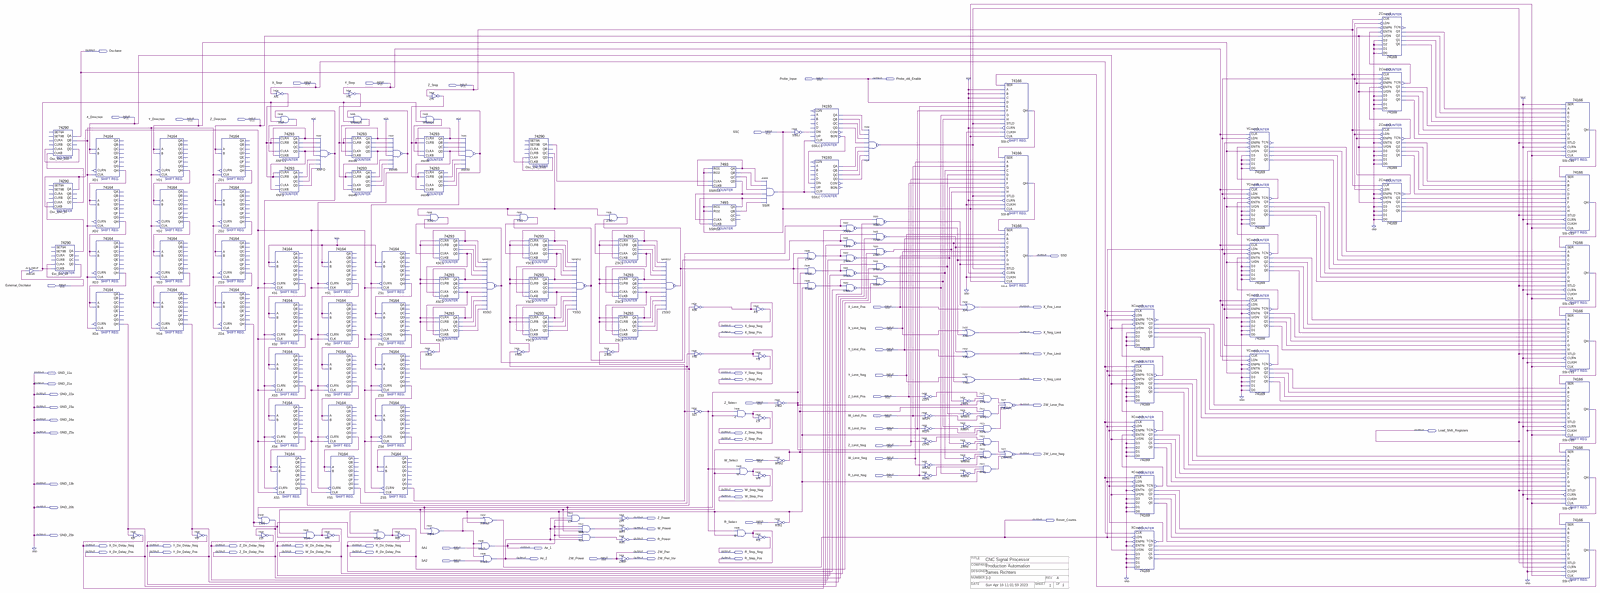
[diagram p0: schematic sheet, whole]
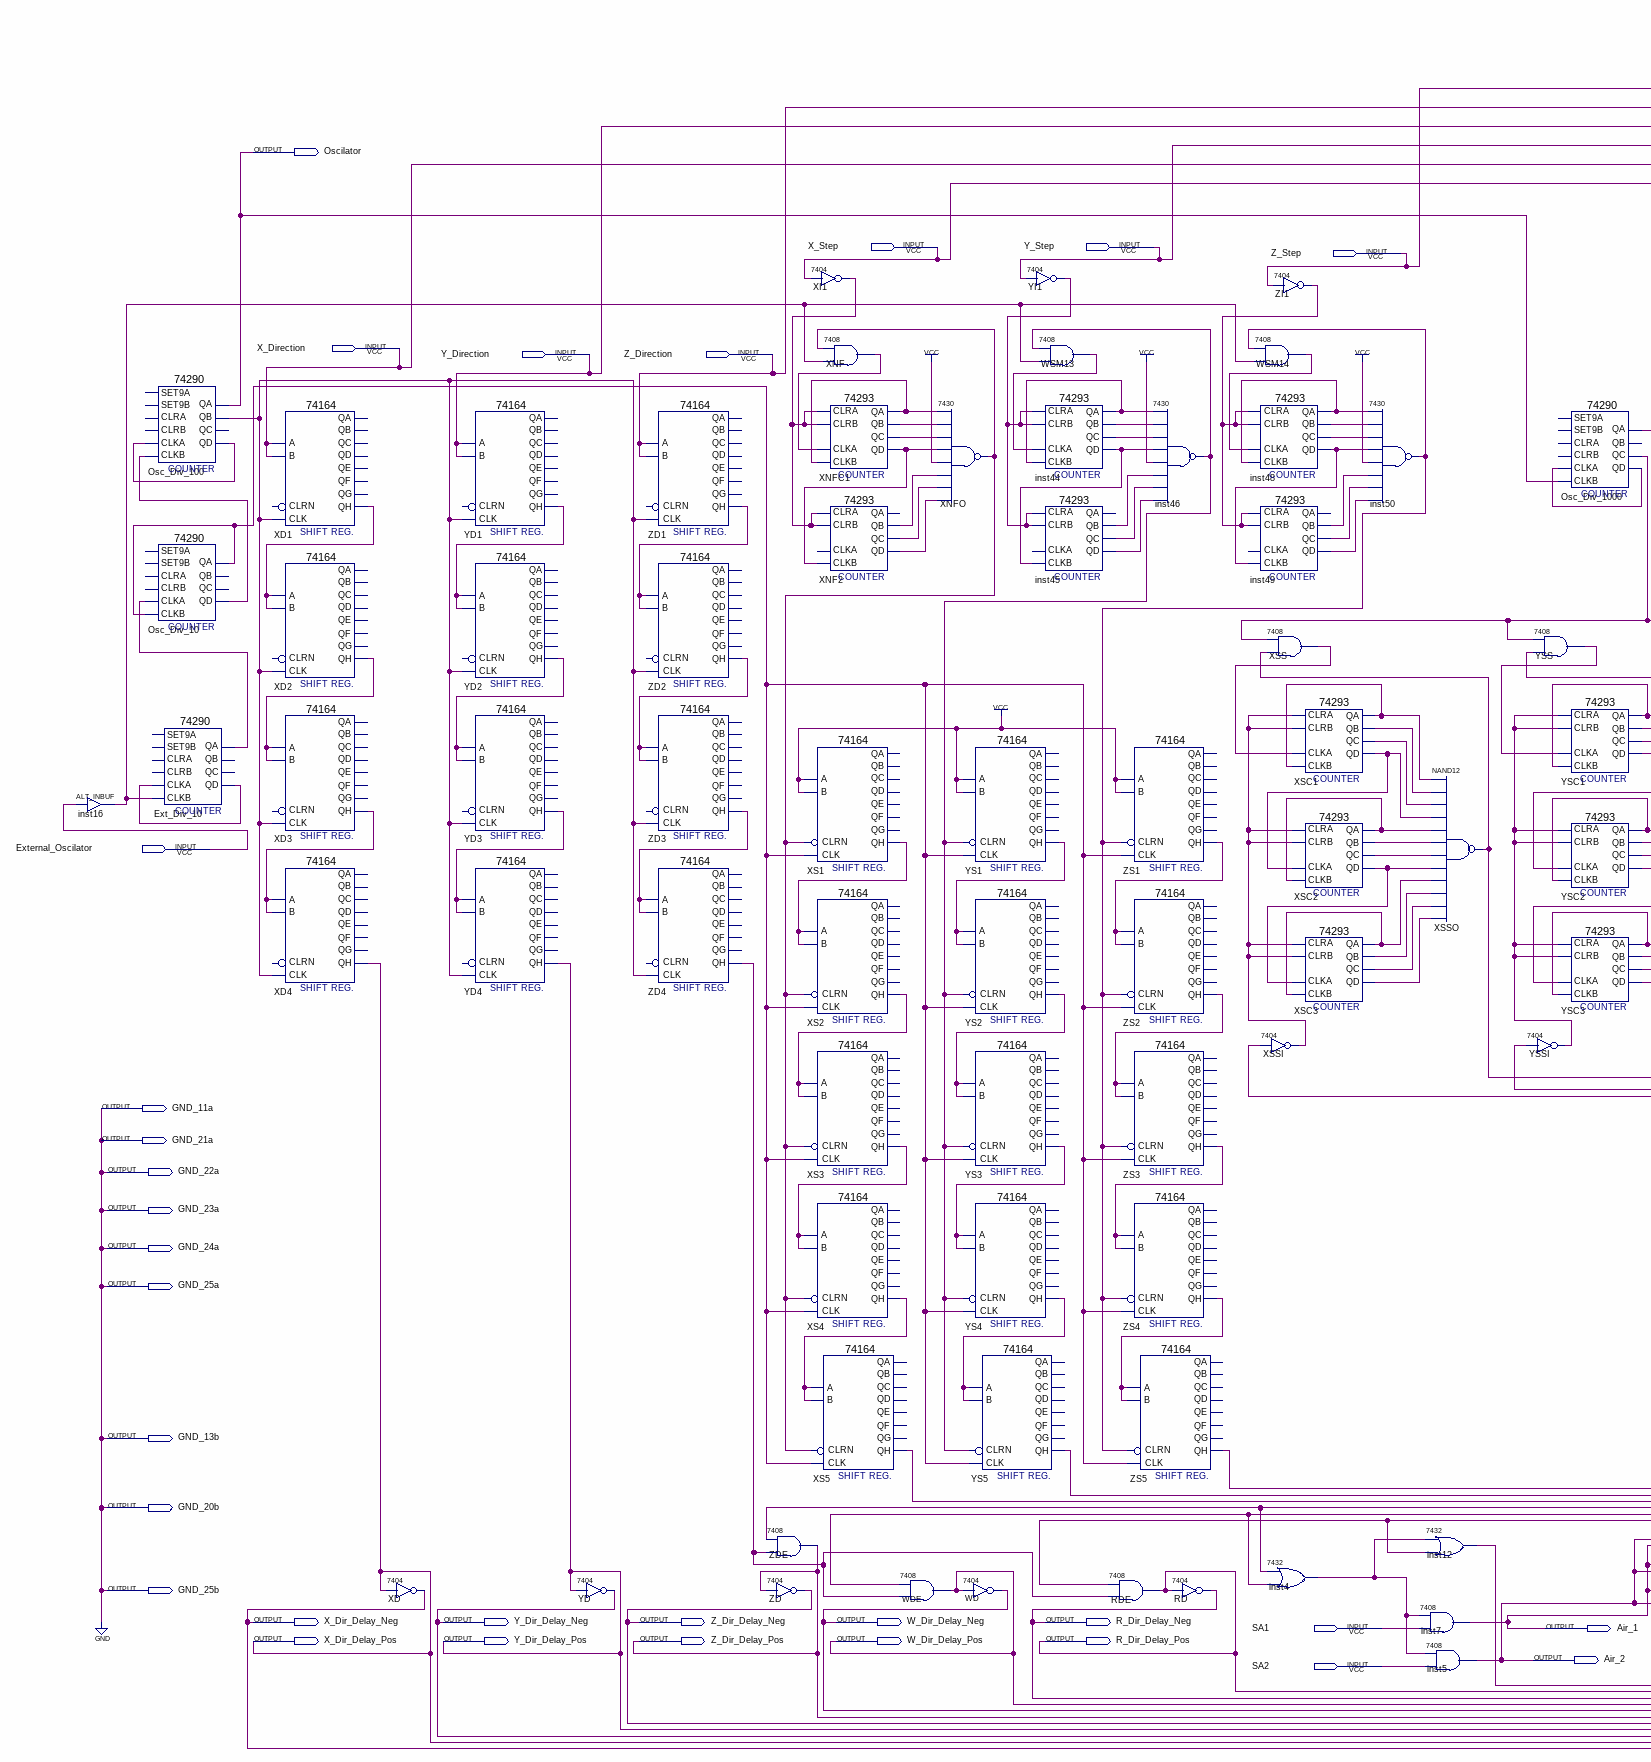
[diagram p1: schematic sheet, left part]
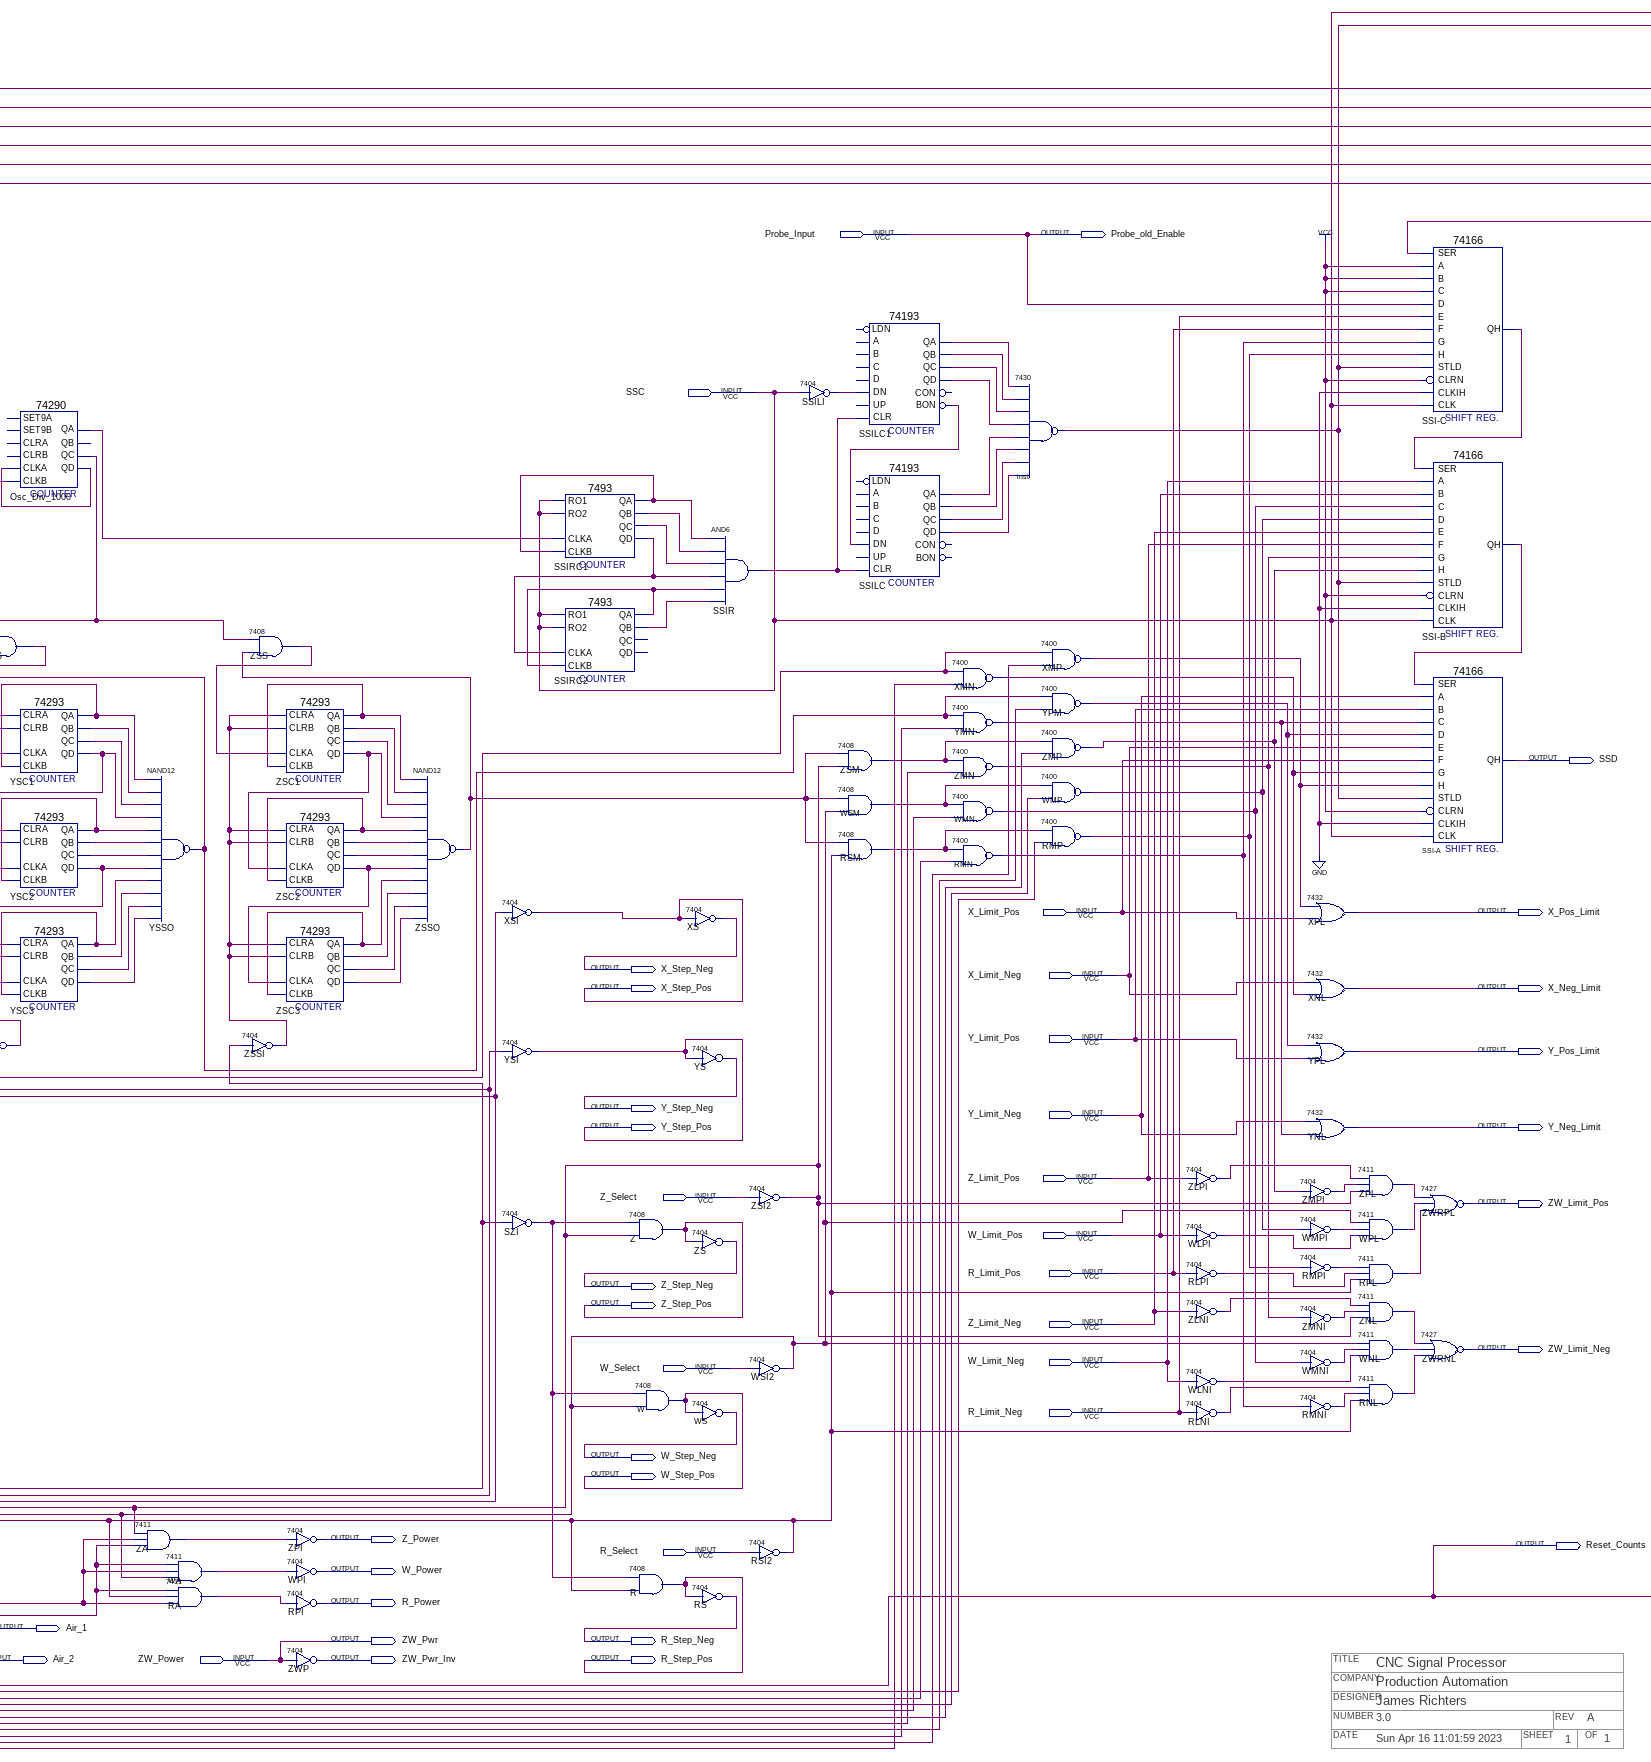
[diagram p2: schematic sheet, centre part]
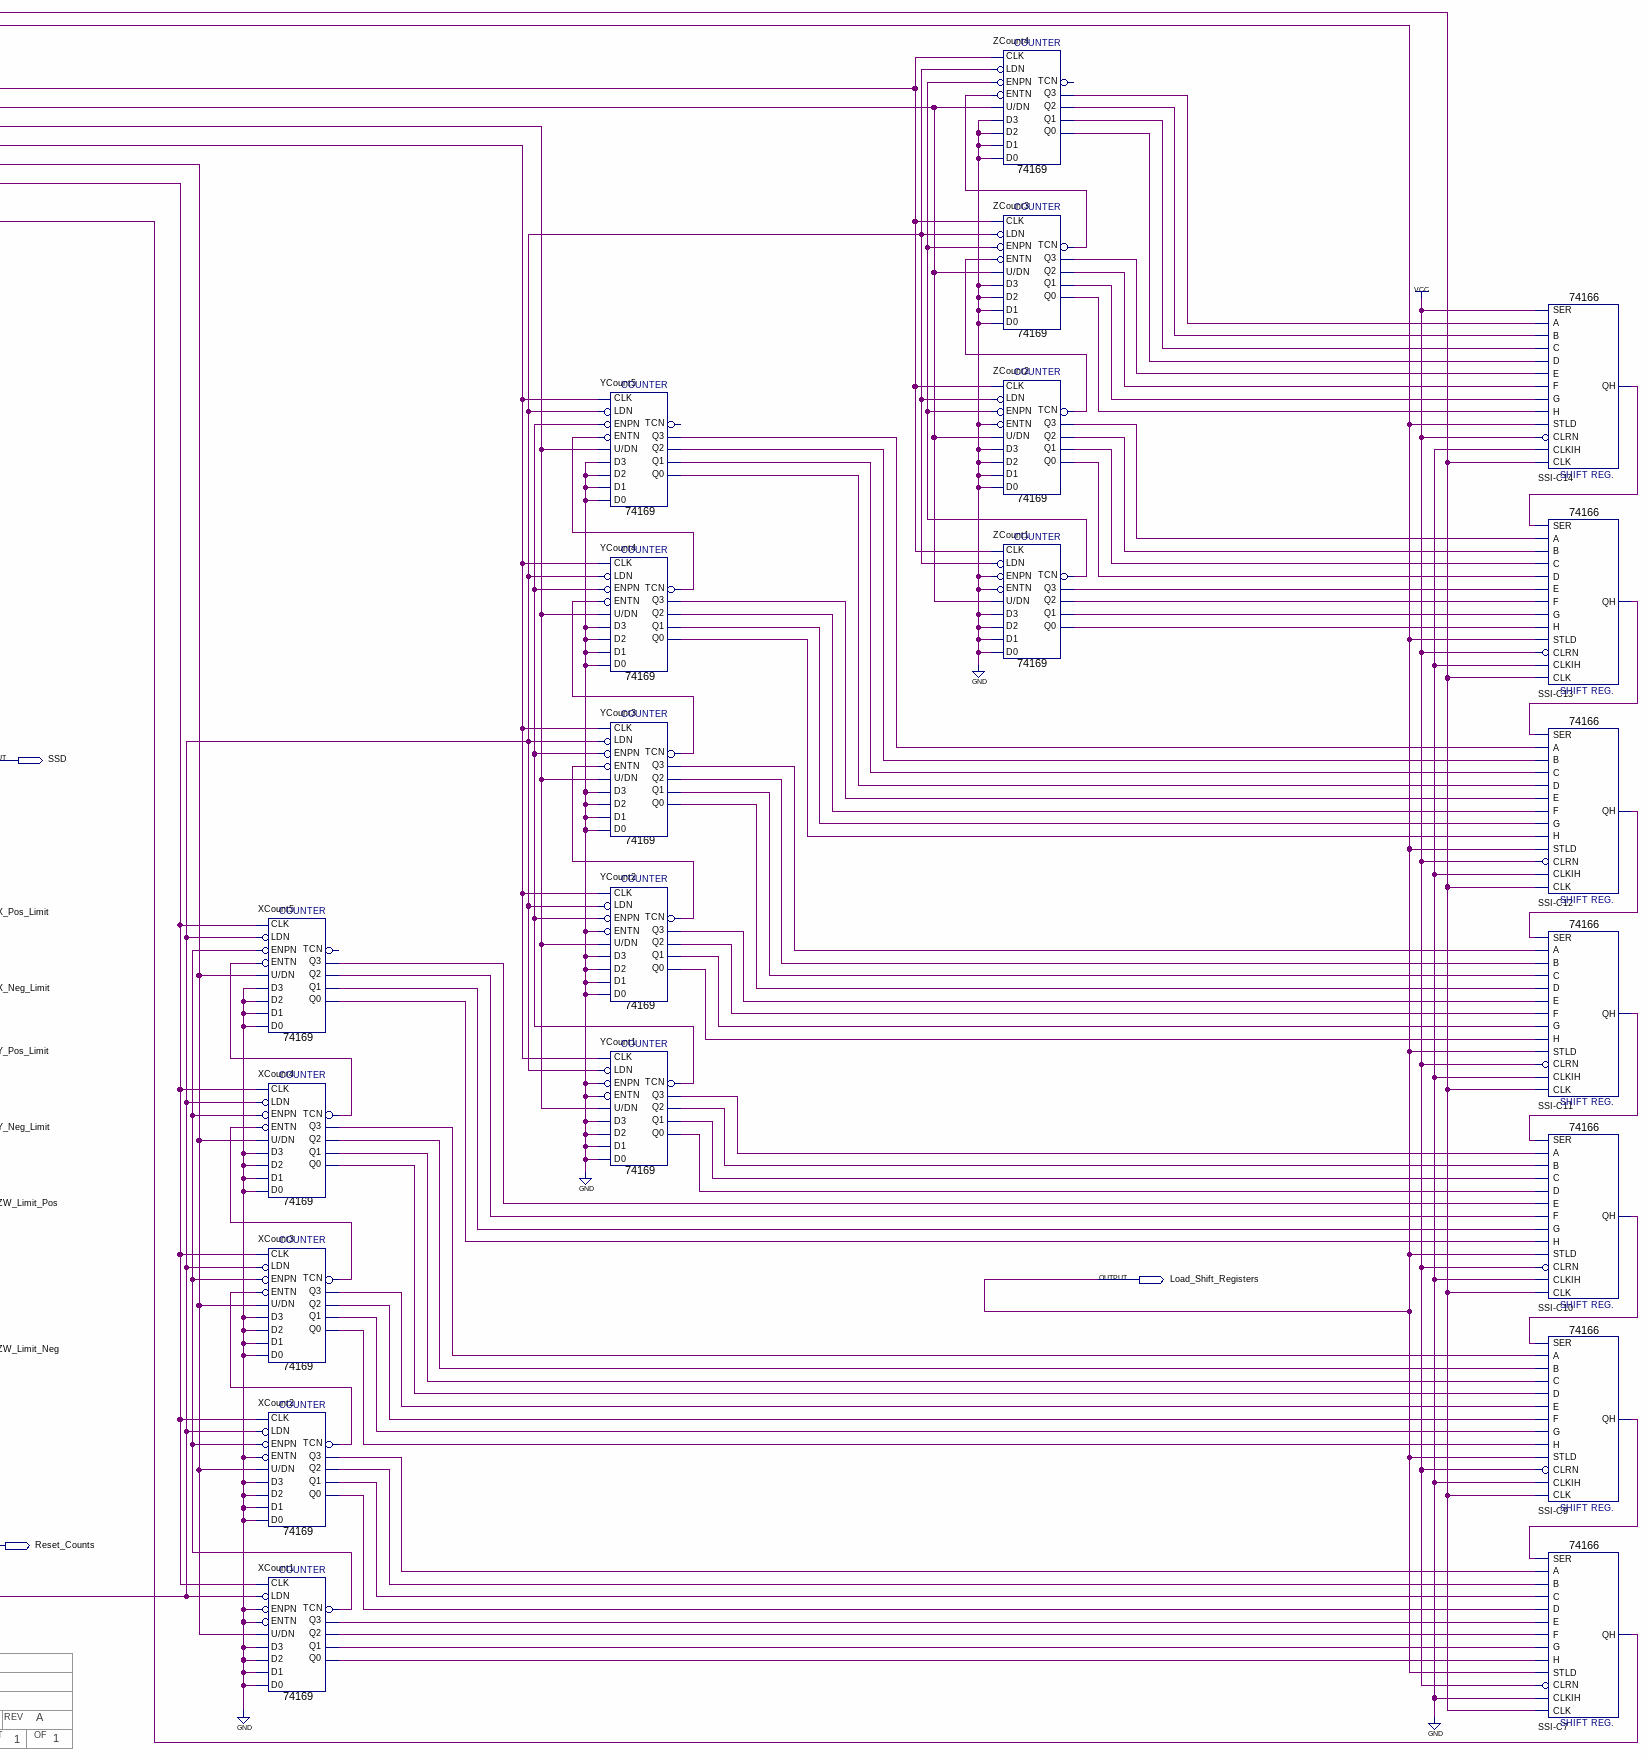
[diagram p3: schematic sheet, right part]
// Quartus schematic Delay_Direction.bdf as structural Verilog: 166 symbols, 72 pins
// Title block: COMPANY: Production Automation; DATE: Sun Apr 16 11:01:59 2023; DESIGNER: James Richters; NUMBER: 3.0; OF: 1; REV: A; SHEET: 1; TITLE: CNC Signal Processor
module Delay_Direction (
  input  Probe_Input,
  input  X_Step,
  input  Y_Step,
  input  Z_Step,
  input  X_Direction,
  input  Y_Direction,
  input  Z_Direction,
  input  SSC,
  input  External_Oscilator,
  input  X_Limit_Pos,
  input  X_Limit_Neg,
  input  Y_Limit_Pos,
  input  Y_Limit_Neg,
  input  Z_Limit_Pos,
  input  Z_Select,
  input  W_Limit_Pos,
  input  R_Limit_Pos,
  input  Z_Limit_Neg,
  input  W_Limit_Neg,
  input  W_Select,
  input  R_Limit_Neg,
  input  R_Select,
  input  SA1,
  input  ZW_Power,
  input  SA2,
  output Oscilator,
  output Probe_old_Enable,
  output SSD,
  output X_Pos_Limit,
  output X_Step_Neg,
  output X_Step_Pos,
  output X_Neg_Limit,
  output Y_Pos_Limit,
  output GND_11a,
  output Y_Step_Neg,
  output Y_Step_Pos,
  output Y_Neg_Limit,
  output GND_21a,
  output GND_22a,
  output ZW_Limit_Pos,
  output GND_23a,
  output GND_24a,
  output Load_Shift_Registers,
  output GND_25a,
  output Z_Step_Neg,
  output Z_Step_Pos,
  output ZW_Limit_Neg,
  output GND_13b,
  output W_Step_Neg,
  output W_Step_Pos,
  output GND_20b,
  output Z_Power,
  output Reset_Counts,
  output W_Power,
  output GND_25b,
  output R_Power,
  output X_Dir_Delay_Neg,
  output Y_Dir_Delay_Neg,
  output Z_Dir_Delay_Neg,
  output W_Dir_Delay_Neg,
  output R_Dir_Delay_Neg,
  output Air_1,
  output X_Dir_Delay_Pos,
  output Y_Dir_Delay_Pos,
  output Z_Dir_Delay_Pos,
  output W_Dir_Delay_Pos,
  output R_Dir_Delay_Pos,
  output ZW_Pwr,
  output R_Step_Neg,
  output Air_2,
  output ZW_Pwr_Inv,
  output R_Step_Pos
);

  wire Ext_Div_10_qa, Ext_Div_10_qd, inst4_1, inst16_o, inst44_qa, inst44_qb, inst44_qc, inst44_qd,
       inst45_qb, inst45_qc, inst45_qd, inst46_1, inst48_qa, inst48_qb, inst48_qc, inst48_qd, inst49_qb,
       inst49_qc, inst49_qd, inst50_1, Osc_Div_10_qa, Osc_Div_10_qd, Osc_Div_100_qb, Osc_Div_100_qd,
       Osc_Div_1000_qa, Osc_Div_1000_qc, Osc_Div_1000_qd, RA_1, RLNI_1, RLPI_1, RMN_1, RMNI_1, RMP_1, RMPI_1,
       RNL_1, RPL_1, RSI2_1, RSM_1, SSI_B_qh, SSI_C7_qh, SSI_C9_qh, SSI_C10_qh, SSI_C11_qh, SSI_C12_qh,
       SSI_C13_qh, SSI_C14_qh, SSI_C_qh, SSILC1_bon, SSILC1_qa, SSILC1_qb, SSILC1_qc, SSILC1_qd, SSILC_qa,
       SSILC_qb, SSILC_qc, SSILC_qd, SSILI_1, SSIR_out, SSIRC1_qa, SSIRC1_qb, SSIRC1_qc, SSIRC1_qd,
       SSIRC2_qa, SSIRC2_qb, SZI_1, WA_1, WLNI_1, WLPI_1, WMN_1, WMNI_1, WMP_1, WMPI_1, WNL_1, WPL_1, WSI2_1,
       WSM13_1, WSM14_1, WSM_1, XCount1_q0, XCount1_q1, XCount1_q2, XCount1_q3, XCount1_tcn, XCount2_q0,
       XCount2_q1, XCount2_q2, XCount2_q3, XCount2_tcn, XCount3_q0, XCount3_q1, XCount3_q2, XCount3_q3,
       XCount3_tcn, XCount4_q0, XCount4_q1, XCount4_q2, XCount4_q3, XCount4_tcn, XCount5_q0, XCount5_q1,
       XCount5_q2, XCount5_q3, XD1_qh, XD2_qh, XD3_qh, XI1_1, XMN_1, XMP_1, XNF2_qb, XNF2_qc, XNF2_qd, XNF_1,
       XNFC1_qa, XNFC1_qb, XNFC1_qc, XNFC1_qd, XNFO_1, XS1_qh, XS2_qh, XS3_qh, XS4_qh, XS5_qh, XSC1_qa,
       XSC1_qb, XSC1_qc, XSC1_qd, XSC2_qa, XSC2_qb, XSC2_qc, XSC2_qd, XSC3_qa, XSC3_qb, XSC3_qc, XSC3_qd,
       XSS_1, XSSI_1, XSSO_out, YCount1_q0, YCount1_q1, YCount1_q2, YCount1_q3, YCount1_tcn, YCount2_q0,
       YCount2_q1, YCount2_q2, YCount2_q3, YCount2_tcn, YCount3_q0, YCount3_q1, YCount3_q2, YCount3_q3,
       YCount3_tcn, YCount4_q0, YCount4_q1, YCount4_q2, YCount4_q3, YCount4_tcn, YCount5_q0, YCount5_q1,
       YCount5_q2, YCount5_q3, YD1_qh, YD2_qh, YD3_qh, YI1_1, YMN_1, YPM_1, YS1_qh, YS2_qh, YS3_qh, YS4_qh,
       YS5_qh, YSC1_qa, YSC1_qb, YSC1_qc, YSC1_qd, YSC2_qa, YSC2_qb, YSC2_qc, YSC2_qd, YSC3_qa, YSC3_qb,
       YSC3_qc, YSC3_qd, YSS_1, YSSI_1, YSSO_out, ZA_1, ZCount1_q0, ZCount1_q1, ZCount1_q2, ZCount1_q3,
       ZCount1_tcn, ZCount2_q0, ZCount2_q1, ZCount2_q2, ZCount2_q3, ZCount2_tcn, ZCount3_q0, ZCount3_q1,
       ZCount3_q2, ZCount3_q3, ZCount3_tcn, ZCount4_q0, ZCount4_q1, ZCount4_q2, ZCount4_q3, ZD1_qh, ZD2_qh,
       ZD3_qh, ZD4_qh, ZI1_1, ZLNI_1, ZLPI_1, ZMN_1, ZMNI_1, ZMP_1, ZMPI_1, ZNL_1, ZPL_1, ZS1_qh, ZS2_qh,
       ZS3_qh, ZS4_qh, ZS5_qh, ZSC1_qa, ZSC1_qb, ZSC1_qc, ZSC1_qd, ZSC2_qa, ZSC2_qb, ZSC2_qc, ZSC2_qd,
       ZSC3_qa, ZSC3_qb, ZSC3_qc, ZSC3_qd, ZSI2_1, ZSM_1, ZSS_1, ZSSI_1, ZSSO_out;

  ALT_INBUF inst16 (.i(External_Oscilator), .o(inst16_o));
  \74290  Osc_Div_100 (
    .CLKB(Osc_Div_10_qd), .CLKA(Osc_Div_100_qd), .QB(Osc_Div_100_qb), .QD(Osc_Div_100_qd), .QA(Oscilator));  // open: CLRA, SET9B, SET9A, CLRB, QC
  \74290  Osc_Div_10 (
    .CLKB(Osc_Div_10_qa), .CLKA(Ext_Div_10_qa), .QD(Osc_Div_10_qd), .QA(Osc_Div_10_qa));  // open: CLRA, SET9B, SET9A, CLRB, QB, QC
  \74290  Ext_Div_10 (
    .CLKB(inst16_o), .CLKA(Ext_Div_10_qd), .QD(Ext_Div_10_qd), .QA(Ext_Div_10_qa));  // open: CLRA, SET9B, SET9A, CLRB, QB, QC
  \74164  XD1 (
    .CLK(Osc_Div_100_qb), .B(X_Direction), .A(X_Direction), .QH(XD1_qh));  // open: CLRN, QD, QC, QA, QF, QG, QE, QB
  \74164  XD2 (.CLK(Osc_Div_100_qb), .B(XD1_qh), .A(XD1_qh), .QH(XD2_qh));  // open: CLRN, QD, QC, QA, QF, QG, QE, QB
  \74164  XD3 (.CLK(Osc_Div_100_qb), .B(XD2_qh), .A(XD2_qh), .QH(XD3_qh));  // open: CLRN, QD, QC, QA, QF, QG, QE, QB
  \74164  XD4 (
    .CLK(Osc_Div_100_qb), .B(XD3_qh), .A(XD3_qh), .QH(X_Dir_Delay_Pos));  // open: CLRN, QD, QC, QA, QF, QG, QE, QB
  \7404  XD (.\2 (X_Dir_Delay_Pos), .\1 (X_Dir_Delay_Neg));
  \74164  YD1 (
    .CLK(Osc_Div_100_qb), .B(Y_Direction), .A(Y_Direction), .QH(YD1_qh));  // open: CLRN, QD, QC, QA, QF, QG, QE, QB
  \74164  YD2 (.CLK(Osc_Div_100_qb), .B(YD1_qh), .A(YD1_qh), .QH(YD2_qh));  // open: CLRN, QD, QC, QA, QF, QG, QE, QB
  \74164  YD3 (.CLK(Osc_Div_100_qb), .B(YD2_qh), .A(YD2_qh), .QH(YD3_qh));  // open: CLRN, QD, QC, QA, QF, QG, QE, QB
  \74164  YD4 (
    .CLK(Osc_Div_100_qb), .B(YD3_qh), .A(YD3_qh), .QH(Y_Dir_Delay_Pos));  // open: CLRN, QD, QC, QA, QF, QG, QE, QB
  \7404  YD (.\2 (Y_Dir_Delay_Pos), .\1 (Y_Dir_Delay_Neg));
  \74164  ZD1 (
    .CLK(Osc_Div_100_qb), .B(Z_Direction), .A(Z_Direction), .QH(ZD1_qh));  // open: CLRN, QD, QC, QA, QF, QG, QE, QB
  \74164  ZD2 (.CLK(Osc_Div_100_qb), .B(ZD1_qh), .A(ZD1_qh), .QH(ZD2_qh));  // open: CLRN, QD, QC, QA, QF, QG, QE, QB
  \74164  ZD3 (.CLK(Osc_Div_100_qb), .B(ZD2_qh), .A(ZD2_qh), .QH(ZD3_qh));  // open: CLRN, QD, QC, QA, QF, QG, QE, QB
  \74164  ZD4 (.CLK(Osc_Div_100_qb), .B(ZD3_qh), .A(ZD3_qh), .QH(ZD4_qh));  // open: CLRN, QD, QC, QA, QF, QG, QE, QB
  \7408  ZDE (.\3 (ZD4_qh), .\2 (ZSI2_1), .\1 (Z_Dir_Delay_Pos));
  \7404  ZD (.\2 (Z_Dir_Delay_Pos), .\1 (Z_Dir_Delay_Neg));
  \7404  XI1 (.\2 (X_Step), .\1 (XI1_1));
  \7408  XNF (.\3 (inst16_o), .\2 (XNFO_1), .\1 (XNF_1));
  \74293  XNFC1 (
    .CLKB(XNFC1_qa), .CLRB(XI1_1), .CLRA(XI1_1), .CLKA(XNF_1), .QB(XNFC1_qb), .QC(XNFC1_qc), .QD(XNFC1_qd),
    .QA(XNFC1_qa));
  \74293  XNF2 (
    .CLKB(XNFC1_qd), .CLRB(XI1_1), .CLRA(XI1_1), .QB(XNF2_qb), .QC(XNF2_qc), .QD(XNF2_qd));  // open: CLKA, QA
  \74164  XS1 (
    .CLRN(XNFO_1), .CLK(Osc_Div_10_qa), .B(1'b1), .A(1'b1), .QH(XS1_qh));  // open: QD, QC, QA, QF, QG, QE, QB
  \74164  XS2 (
    .CLRN(XNFO_1), .CLK(Osc_Div_10_qa), .B(XS1_qh), .A(XS1_qh), .QH(XS2_qh));  // open: QD, QC, QA, QF, QG, QE, QB
  \74164  XS3 (
    .CLRN(XNFO_1), .CLK(Osc_Div_10_qa), .B(XS2_qh), .A(XS2_qh), .QH(XS3_qh));  // open: QD, QC, QA, QF, QG, QE, QB
  \74164  XS4 (
    .CLRN(XNFO_1), .CLK(Osc_Div_10_qa), .B(XS3_qh), .A(XS3_qh), .QH(XS4_qh));  // open: QD, QC, QA, QF, QG, QE, QB
  \74164  XS5 (
    .CLRN(XNFO_1), .CLK(Osc_Div_10_qa), .B(XS4_qh), .A(XS4_qh), .QH(XS5_qh));  // open: QD, QC, QA, QF, QG, QE, QB
  \7408  WDE (.\3 (ZD4_qh), .\2 (WSI2_1), .\1 (W_Dir_Delay_Pos));
  \7430  XNFO (
    .\9 (XNF2_qd), .\7 (XNF2_qb), .\8 (XNF2_qc), .\5 (XNFC1_qd), .\2 (XNFC1_qa), .\6 (1'b1), .\3 (XNFC1_qb),
    .\4 (XNFC1_qc), .\1 (XNFO_1));
  \74164  YS1 (
    .CLRN(inst46_1), .CLK(Osc_Div_10_qa), .B(1'b1), .A(1'b1), .QH(YS1_qh));  // open: QD, QC, QA, QF, QG, QE, QB
  \74164  YS2 (
    .CLRN(inst46_1), .CLK(Osc_Div_10_qa), .B(YS1_qh), .A(YS1_qh), .QH(YS2_qh));  // open: QD, QC, QA, QF, QG, QE, QB
  \74164  YS3 (
    .CLRN(inst46_1), .CLK(Osc_Div_10_qa), .B(YS2_qh), .A(YS2_qh), .QH(YS3_qh));  // open: QD, QC, QA, QF, QG, QE, QB
  \74164  YS4 (
    .CLRN(inst46_1), .CLK(Osc_Div_10_qa), .B(YS3_qh), .A(YS3_qh), .QH(YS4_qh));  // open: QD, QC, QA, QF, QG, QE, QB
  \74164  YS5 (
    .CLRN(inst46_1), .CLK(Osc_Div_10_qa), .B(YS4_qh), .A(YS4_qh), .QH(YS5_qh));  // open: QD, QC, QA, QF, QG, QE, QB
  \7404  WD (.\2 (W_Dir_Delay_Pos), .\1 (W_Dir_Delay_Neg));
  \7404  YI1 (.\2 (Y_Step), .\1 (YI1_1));
  \7408  WSM13 (.\3 (inst16_o), .\2 (inst46_1), .\1 (WSM13_1));
  \74293  inst44 (
    .CLKB(inst44_qa), .CLRB(YI1_1), .CLRA(YI1_1), .CLKA(WSM13_1), .QB(inst44_qb), .QC(inst44_qc),
    .QD(inst44_qd), .QA(inst44_qa));
  \74293  inst45 (
    .CLKB(inst44_qd), .CLRB(YI1_1), .CLRA(YI1_1), .QB(inst45_qb), .QC(inst45_qc), .QD(inst45_qd));  // open: CLKA, QA
  \74164  ZS1 (
    .CLRN(inst50_1), .CLK(Osc_Div_10_qa), .B(1'b1), .A(1'b1), .QH(ZS1_qh));  // open: QD, QC, QA, QF, QG, QE, QB
  \74164  ZS2 (
    .CLRN(inst50_1), .CLK(Osc_Div_10_qa), .B(ZS1_qh), .A(ZS1_qh), .QH(ZS2_qh));  // open: QD, QC, QA, QF, QG, QE, QB
  \74164  ZS3 (
    .CLRN(inst50_1), .CLK(Osc_Div_10_qa), .B(ZS2_qh), .A(ZS2_qh), .QH(ZS3_qh));  // open: QD, QC, QA, QF, QG, QE, QB
  \74164  ZS4 (
    .CLRN(inst50_1), .CLK(Osc_Div_10_qa), .B(ZS3_qh), .A(ZS3_qh), .QH(ZS4_qh));  // open: QD, QC, QA, QF, QG, QE, QB
  \74164  ZS5 (
    .CLRN(inst50_1), .CLK(Osc_Div_10_qa), .B(ZS4_qh), .A(ZS4_qh), .QH(ZS5_qh));  // open: QD, QC, QA, QF, QG, QE, QB
  \7408  RDE (.\3 (ZD4_qh), .\2 (RSI2_1), .\1 (R_Dir_Delay_Pos));
  \7430  inst46 (
    .\9 (inst45_qd), .\7 (inst45_qb), .\8 (inst45_qc), .\5 (inst44_qd), .\2 (inst44_qa), .\6 (1'b1),
    .\3 (inst44_qb), .\4 (inst44_qc), .\1 (inst46_1));
  \7404  RD (.\2 (R_Dir_Delay_Pos), .\1 (R_Dir_Delay_Neg));
  \7404  ZI1 (.\2 (Z_Step), .\1 (ZI1_1));
  \7408  WSM14 (.\3 (inst16_o), .\2 (inst50_1), .\1 (WSM14_1));
  \74293  inst48 (
    .CLKB(inst48_qa), .CLRB(ZI1_1), .CLRA(ZI1_1), .CLKA(WSM14_1), .QB(inst48_qb), .QC(inst48_qc),
    .QD(inst48_qd), .QA(inst48_qa));
  \74293  inst49 (
    .CLKB(inst48_qd), .CLRB(ZI1_1), .CLRA(ZI1_1), .QB(inst49_qb), .QC(inst49_qc), .QD(inst49_qd));  // open: CLKA, QA
  \7408  XSS (.\3 (XSSO_out), .\2 (Osc_Div_1000_qc), .\1 (XSS_1));
  \7404  XSSI (.\2 (XS5_qh), .\1 (XSSI_1));
  \7432  inst4 (.\2 (ZSI2_1), .\3 (WSI2_1), .\1 (inst4_1));
  \74293  XSC1 (
    .CLKB(XSC1_qa), .CLRB(XSSI_1), .CLRA(XSSI_1), .CLKA(XSS_1), .QB(XSC1_qb), .QC(XSC1_qc), .QD(XSC1_qd),
    .QA(XSC1_qa));
  \74293  XSC2 (
    .CLKB(XSC2_qa), .CLRB(XSSI_1), .CLRA(XSSI_1), .CLKA(XSC1_qd), .QB(XSC2_qb), .QC(XSC2_qc), .QD(XSC2_qd),
    .QA(XSC2_qa));
  \74293  XSC3 (
    .CLKB(XSC3_qa), .CLRB(XSSI_1), .CLRA(XSSI_1), .CLKA(XSC2_qd), .QB(XSC3_qb), .QC(XSC3_qc), .QD(XSC3_qd),
    .QA(XSC3_qa));
  \7430  inst50 (
    .\9 (inst49_qd), .\7 (inst49_qb), .\8 (inst49_qc), .\5 (inst48_qd), .\2 (inst48_qa), .\6 (1'b1),
    .\3 (inst48_qb), .\4 (inst48_qc), .\1 (inst50_1));
  nand XSSO (XSSO_out, XSC1_qa, XSC1_qb, XSC1_qc, XSC1_qd, XSC2_qa, XSC2_qb, XSC2_qc, XSC2_qd, XSC3_qa, XSC3_qb, XSC3_qc, XSC3_qd);
  \7432  inst12 (.\2 (inst4_1), .\3 (RSI2_1), .\1 (Reset_Counts));
  \7408  inst7 (.\3 (SA1), .\2 (inst4_1), .\1 (Air_1));
  \7408  inst5 (.\3 (SA2), .\2 (inst4_1), .\1 (Air_2));
  \7408  YSS (.\3 (YSSO_out), .\2 (Osc_Div_1000_qc), .\1 (YSS_1));
  \7404  YSSI (.\2 (YS5_qh), .\1 (YSSI_1));
  \74290  Osc_Div_1000 (
    .CLKB(Oscilator), .CLKA(Osc_Div_1000_qd), .QC(Osc_Div_1000_qc), .QD(Osc_Div_1000_qd), .QA(Osc_Div_1000_qa));  // open: CLRA, SET9B, SET9A, CLRB, QB
  \74293  YSC1 (
    .CLKB(YSC1_qa), .CLRB(YSSI_1), .CLRA(YSSI_1), .CLKA(YSS_1), .QB(YSC1_qb), .QC(YSC1_qc), .QD(YSC1_qd),
    .QA(YSC1_qa));
  \74293  YSC2 (
    .CLKB(YSC2_qa), .CLRB(YSSI_1), .CLRA(YSSI_1), .CLKA(YSC1_qd), .QB(YSC2_qb), .QC(YSC2_qc), .QD(YSC2_qd),
    .QA(YSC2_qa));
  \74293  YSC3 (
    .CLKB(YSC3_qa), .CLRB(YSSI_1), .CLRA(YSSI_1), .CLKA(YSC2_qd), .QB(YSC3_qb), .QC(YSC3_qc), .QD(YSC3_qd),
    .QA(YSC3_qa));
  \7411  ZA (.\2 (ZSI2_1), .\3 (Air_2), .\4 (Air_1), .\1 (ZA_1));
  nand YSSO (YSSO_out, YSC1_qa, YSC1_qb, YSC1_qc, YSC1_qd, YSC2_qa, YSC2_qb, YSC2_qc, YSC2_qd, YSC3_qa, YSC3_qb, YSC3_qc, YSC3_qd);
  \7411  WA (.\2 (Air_1), .\3 (Air_2), .\4 (WSI2_1), .\1 (WA_1));
  \7411  RA (.\2 (Air_1), .\3 (RSI2_1), .\4 (Air_2), .\1 (RA_1));
  \7408  ZSS (.\3 (ZSSO_out), .\2 (Osc_Div_1000_qc), .\1 (ZSS_1));
  \74293  ZSC1 (
    .CLKB(ZSC1_qa), .CLRB(ZSSI_1), .CLRA(ZSSI_1), .CLKA(ZSS_1), .QB(ZSC1_qb), .QC(ZSC1_qc), .QD(ZSC1_qd),
    .QA(ZSC1_qa));
  \74293  ZSC2 (
    .CLKB(ZSC2_qa), .CLRB(ZSSI_1), .CLRA(ZSSI_1), .CLKA(ZSC1_qd), .QB(ZSC2_qb), .QC(ZSC2_qc), .QD(ZSC2_qd),
    .QA(ZSC2_qa));
  \74293  ZSC3 (
    .CLKB(ZSC3_qa), .CLRB(ZSSI_1), .CLRA(ZSSI_1), .CLKA(ZSC2_qd), .QB(ZSC3_qb), .QC(ZSC3_qc), .QD(ZSC3_qd),
    .QA(ZSC3_qa));
  \7404  ZSSI (.\2 (ZS5_qh), .\1 (ZSSI_1));
  \7404  ZPI (.\2 (ZA_1), .\1 (Z_Power));
  \7404  WPI (.\2 (WA_1), .\1 (W_Power));
  \7404  RPI (.\2 (RA_1), .\1 (R_Power));
  \7404  ZWP (.\2 (ZW_Power), .\1 (ZW_Pwr_Inv));
  nand ZSSO (ZSSO_out, ZSC1_qa, ZSC1_qb, ZSC1_qc, ZSC1_qd, ZSC2_qa, ZSC2_qb, ZSC2_qc, ZSC2_qd, ZSC3_qa, ZSC3_qb, ZSC3_qc, ZSC3_qd);
  \7404  XSI (.\2 (XS5_qh), .\1 (X_Step_Pos));
  \7404  YSI (.\2 (YS5_qh), .\1 (Y_Step_Pos));
  \7404  SZI (.\2 (ZS5_qh), .\1 (SZI_1));
  \7493  SSIRC1 (
    .RO1(SSC), .RO2(SSC), .CLKA(Osc_Div_1000_qa), .CLKB(SSIRC1_qa), .QC(SSIRC1_qc), .QB(SSIRC1_qb),
    .QA(SSIRC1_qa), .QD(SSIRC1_qd));
  \7493  SSIRC2 (
    .RO1(SSC), .RO2(SSC), .CLKA(SSIRC1_qd), .CLKB(SSIRC2_qa), .QB(SSIRC2_qb), .QA(SSIRC2_qa));  // open: QC, QD
  \7408  Z (.\3 (ZSI2_1), .\2 (SZI_1), .\1 (Z_Step_Pos));
  \7408  W (.\3 (WSI2_1), .\2 (SZI_1), .\1 (W_Step_Pos));
  \7408  R (.\3 (RSI2_1), .\2 (SZI_1), .\1 (R_Step_Pos));
  \7404  XS (.\2 (X_Step_Pos), .\1 (X_Step_Neg));
  \7404  YS (.\2 (Y_Step_Pos), .\1 (Y_Step_Neg));
  \7404  ZS (.\2 (Z_Step_Pos), .\1 (Z_Step_Neg));
  \7404  WS (.\2 (W_Step_Pos), .\1 (W_Step_Neg));
  \7404  RS (.\2 (R_Step_Pos), .\1 (R_Step_Neg));
  and SSIR (SSIR_out, SSIRC1_qa, SSIRC1_qb, SSIRC1_qc, SSIRC1_qd, SSIRC2_qa, SSIRC2_qb);
  \7404  ZSI2 (.\2 (Z_Select), .\1 (ZSI2_1));
  \7404  WSI2 (.\2 (W_Select), .\1 (WSI2_1));
  \7404  RSI2 (.\2 (R_Select), .\1 (RSI2_1));
  \7404  SSILI (.\2 (SSC), .\1 (SSILI_1));
  \7408  ZSM (.\3 (ZSI2_1), .\2 (ZSSO_out), .\1 (ZSM_1));
  \7408  WSM (.\3 (WSI2_1), .\2 (ZSSO_out), .\1 (WSM_1));
  \7408  RSM (.\3 (RSI2_1), .\2 (ZSSO_out), .\1 (RSM_1));
  \74193  SSILC1 (
    .CLR(SSIR_out), .DN(SSILI_1), .QB(SSILC1_qb), .QA(SSILC1_qa), .QD(SSILC1_qd), .QC(SSILC1_qc),
    .BON(SSILC1_bon));  // open: D, C, B, A, UP, LDN, CON
  \74193  SSILC (
    .CLR(SSIR_out), .DN(SSILC1_bon), .QB(SSILC_qb), .QA(SSILC_qa), .QD(SSILC_qd), .QC(SSILC_qc));  // open: D, C, B, A, UP, LDN, CON, BON
  \7400  XMN (.\3 (X_Dir_Delay_Neg), .\2 (XSSO_out), .\1 (XMN_1));
  \7400  YMN (.\3 (Y_Dir_Delay_Neg), .\2 (YSSO_out), .\1 (YMN_1));
  \7400  ZMN (.\3 (Z_Dir_Delay_Neg), .\2 (ZSM_1), .\1 (ZMN_1));
  \7400  WMN (.\3 (W_Dir_Delay_Neg), .\2 (WSM_1), .\1 (WMN_1));
  \7400  RMN (.\3 (R_Dir_Delay_Neg), .\2 (RSM_1), .\1 (RMN_1));
  \7430  inst (
    .\9 (SSILC_qd), .\7 (SSILC_qb), .\8 (SSILC_qc), .\5 (SSILC1_qd), .\2 (SSILC1_qa), .\6 (SSILC_qa),
    .\3 (SSILC1_qb), .\4 (SSILC1_qc), .\1 (Load_Shift_Registers));
  \7400  XMP (.\3 (X_Dir_Delay_Pos), .\2 (XSSO_out), .\1 (XMP_1));
  \7400  YPM (.\3 (Y_Dir_Delay_Pos), .\2 (YSSO_out), .\1 (YPM_1));
  \7400  ZMP (.\3 (Z_Dir_Delay_Pos), .\2 (ZSM_1), .\1 (ZMP_1));
  \7400  WMP (.\3 (W_Dir_Delay_Pos), .\2 (WSM_1), .\1 (WMP_1));
  \7400  RMP (.\3 (R_Dir_Delay_Pos), .\2 (RSM_1), .\1 (RMP_1));
  \7404  ZLPI (.\2 (Z_Limit_Pos), .\1 (ZLPI_1));
  \7404  WLPI (.\2 (W_Limit_Pos), .\1 (WLPI_1));
  \7404  RLPI (.\2 (R_Limit_Pos), .\1 (RLPI_1));
  \7404  ZLNI (.\2 (Z_Limit_Neg), .\1 (ZLNI_1));
  \7404  WLNI (.\2 (W_Limit_Neg), .\1 (WLNI_1));
  \7404  RLNI (.\2 (R_Limit_Neg), .\1 (RLNI_1));
  \7404  ZMPI (.\2 (ZMP_1), .\1 (ZMPI_1));
  \7404  WMPI (.\2 (WMP_1), .\1 (WMPI_1));
  \7404  RMPI (.\2 (RMP_1), .\1 (RMPI_1));
  \7404  ZMNI (.\2 (ZMN_1), .\1 (ZMNI_1));
  \7404  WMNI (.\2 (WMN_1), .\1 (WMNI_1));
  \7404  RMNI (.\2 (RMN_1), .\1 (RMNI_1));
  \7432  XPL (.\2 (XMP_1), .\3 (X_Limit_Pos), .\1 (X_Pos_Limit));
  \7432  XNL (.\2 (X_Limit_Neg), .\3 (XMN_1), .\1 (X_Neg_Limit));
  \7432  YPL (.\2 (YPM_1), .\3 (Y_Limit_Pos), .\1 (Y_Pos_Limit));
  \7432  YNL (.\2 (Y_Limit_Neg), .\3 (YMN_1), .\1 (Y_Neg_Limit));
  \7411  ZPL (.\2 (ZLPI_1), .\3 (ZMPI_1), .\4 (ZSI2_1), .\1 (ZPL_1));
  \7411  WPL (.\2 (WSI2_1), .\3 (WMPI_1), .\4 (WLPI_1), .\1 (WPL_1));
  \7411  RPL (.\2 (RMPI_1), .\3 (RLPI_1), .\4 (RSI2_1), .\1 (RPL_1));
  \7411  ZNL (.\2 (ZLNI_1), .\3 (ZMNI_1), .\4 (ZSI2_1), .\1 (ZNL_1));
  \7411  WNL (.\2 (WSI2_1), .\3 (WMNI_1), .\4 (WLNI_1), .\1 (WNL_1));
  \7411  RNL (.\2 (RLNI_1), .\3 (RMNI_1), .\4 (RSI2_1), .\1 (RNL_1));
  \74166  \SSI-C  (
    .SER(SSI_C7_qh), .A(1'b1), .C(1'b1), .D(Probe_Input), .E(R_Limit_Neg), .B(1'b1),
    .STLD(Load_Shift_Registers), .H(RMP_1), .G(RMN_1), .F(R_Limit_Pos), .CLK(SSC), .CLRN(1'b1), .CLKIH(1'b0),
    .QH(SSI_C_qh));
  \74166  \SSI-B  (
    .SER(SSI_C_qh), .A(W_Limit_Neg), .C(WMN_1), .D(WMP_1), .E(Z_Limit_Neg), .B(W_Limit_Pos),
    .STLD(Load_Shift_Registers), .H(ZMP_1), .G(ZMN_1), .F(Z_Limit_Pos), .CLK(SSC), .CLRN(1'b1), .CLKIH(1'b0),
    .QH(SSI_B_qh));
  \74166  \SSI-A  (
    .SER(SSI_B_qh), .A(Y_Limit_Neg), .C(YMN_1), .D(YPM_1), .E(X_Limit_Neg), .B(Y_Limit_Pos),
    .STLD(Load_Shift_Registers), .H(XMP_1), .G(XMN_1), .F(X_Limit_Pos), .CLK(SSC), .CLRN(1'b1), .CLKIH(1'b0),
    .QH(SSD));
  \7427  ZWRPL (.\4 (RPL_1), .\3 (WPL_1), .\2 (ZPL_1), .\1 (ZW_Limit_Pos));
  \7427  ZWRNL (.\4 (RNL_1), .\3 (WNL_1), .\2 (ZNL_1), .\1 (ZW_Limit_Neg));
  \74169  XCount5 (
    .D1(1'b0), .D2(1'b0), .D0(1'b0), .ENTN(XCount4_tcn), .\U/DN (X_Direction), .D3(1'b0), .LDN(Reset_Counts),
    .CLK(X_Step), .ENPN(XCount1_tcn), .Q2(XCount5_q2), .Q1(XCount5_q1), .Q0(XCount5_q0), .Q3(XCount5_q3));  // open: TCN
  \74169  XCount4 (
    .D1(1'b0), .D2(1'b0), .D0(1'b0), .ENTN(XCount3_tcn), .\U/DN (X_Direction), .D3(1'b0), .LDN(Reset_Counts),
    .CLK(X_Step), .ENPN(XCount1_tcn), .Q2(XCount4_q2), .Q1(XCount4_q1), .Q0(XCount4_q0), .TCN(XCount4_tcn),
    .Q3(XCount4_q3));
  \74169  XCount3 (
    .D1(1'b0), .D2(1'b0), .D0(1'b0), .ENTN(XCount2_tcn), .\U/DN (X_Direction), .D3(1'b0), .LDN(Reset_Counts),
    .CLK(X_Step), .ENPN(XCount1_tcn), .Q2(XCount3_q2), .Q1(XCount3_q1), .Q0(XCount3_q0), .TCN(XCount3_tcn),
    .Q3(XCount3_q3));
  \74169  XCount2 (
    .D1(1'b0), .D2(1'b0), .D0(1'b0), .ENTN(1'b0), .\U/DN (X_Direction), .D3(1'b0), .LDN(Reset_Counts),
    .CLK(X_Step), .ENPN(XCount1_tcn), .Q2(XCount2_q2), .Q1(XCount2_q1), .Q0(XCount2_q0), .TCN(XCount2_tcn),
    .Q3(XCount2_q3));
  \74169  XCount1 (
    .D1(1'b0), .D2(1'b0), .D0(1'b0), .ENTN(1'b0), .\U/DN (X_Direction), .D3(1'b0), .LDN(Reset_Counts),
    .CLK(X_Step), .ENPN(1'b0), .Q2(XCount1_q2), .Q1(XCount1_q1), .Q0(XCount1_q0), .TCN(XCount1_tcn),
    .Q3(XCount1_q3));
  \74169  YCount5 (
    .D1(1'b0), .D2(1'b0), .D0(1'b0), .ENTN(YCount4_tcn), .\U/DN (Y_Direction), .D3(1'b0), .LDN(Reset_Counts),
    .CLK(Y_Step), .ENPN(YCount1_tcn), .Q2(YCount5_q2), .Q1(YCount5_q1), .Q0(YCount5_q0), .Q3(YCount5_q3));  // open: TCN
  \74169  YCount4 (
    .D1(1'b0), .D2(1'b0), .D0(1'b0), .ENTN(YCount3_tcn), .\U/DN (Y_Direction), .D3(1'b0), .LDN(Reset_Counts),
    .CLK(Y_Step), .ENPN(YCount1_tcn), .Q2(YCount4_q2), .Q1(YCount4_q1), .Q0(YCount4_q0), .TCN(YCount4_tcn),
    .Q3(YCount4_q3));
  \74169  YCount3 (
    .D1(1'b0), .D2(1'b0), .D0(1'b0), .ENTN(YCount2_tcn), .\U/DN (Y_Direction), .D3(1'b0), .LDN(Reset_Counts),
    .CLK(Y_Step), .ENPN(YCount1_tcn), .Q2(YCount3_q2), .Q1(YCount3_q1), .Q0(YCount3_q0), .TCN(YCount3_tcn),
    .Q3(YCount3_q3));
  \74169  YCount2 (
    .D1(1'b0), .D2(1'b0), .D0(1'b0), .ENTN(1'b0), .\U/DN (Y_Direction), .D3(1'b0), .LDN(Reset_Counts),
    .CLK(Y_Step), .ENPN(YCount1_tcn), .Q2(YCount2_q2), .Q1(YCount2_q1), .Q0(YCount2_q0), .TCN(YCount2_tcn),
    .Q3(YCount2_q3));
  \74169  YCount1 (
    .D1(1'b0), .D2(1'b0), .D0(1'b0), .ENTN(1'b0), .\U/DN (Y_Direction), .D3(1'b0), .LDN(Reset_Counts),
    .CLK(Y_Step), .ENPN(1'b0), .Q2(YCount1_q2), .Q1(YCount1_q1), .Q0(YCount1_q0), .TCN(YCount1_tcn),
    .Q3(YCount1_q3));
  \74169  ZCount4 (
    .D1(1'b0), .D2(1'b0), .D0(1'b0), .ENTN(ZCount3_tcn), .\U/DN (Z_Direction), .D3(1'b0), .LDN(Reset_Counts),
    .CLK(Z_Step), .ENPN(ZCount1_tcn), .Q2(ZCount4_q2), .Q1(ZCount4_q1), .Q0(ZCount4_q0), .Q3(ZCount4_q3));  // open: TCN
  \74169  ZCount3 (
    .D1(1'b0), .D2(1'b0), .D0(1'b0), .ENTN(ZCount2_tcn), .\U/DN (Z_Direction), .D3(1'b0), .LDN(Reset_Counts),
    .CLK(Z_Step), .ENPN(ZCount1_tcn), .Q2(ZCount3_q2), .Q1(ZCount3_q1), .Q0(ZCount3_q0), .TCN(ZCount3_tcn),
    .Q3(ZCount3_q3));
  \74169  ZCount2 (
    .D1(1'b0), .D2(1'b0), .D0(1'b0), .ENTN(1'b0), .\U/DN (Z_Direction), .D3(1'b0), .LDN(Reset_Counts),
    .CLK(Z_Step), .ENPN(ZCount1_tcn), .Q2(ZCount2_q2), .Q1(ZCount2_q1), .Q0(ZCount2_q0), .TCN(ZCount2_tcn),
    .Q3(ZCount2_q3));
  \74169  ZCount1 (
    .D1(1'b0), .D2(1'b0), .D0(1'b0), .ENTN(1'b0), .\U/DN (Z_Direction), .D3(1'b0), .LDN(Reset_Counts),
    .CLK(Z_Step), .ENPN(1'b0), .Q2(ZCount1_q2), .Q1(ZCount1_q1), .Q0(ZCount1_q0), .TCN(ZCount1_tcn),
    .Q3(ZCount1_q3));
  \74166  \SSI-C14  (
    .SER(1'b1), .A(ZCount4_q3), .C(ZCount4_q1), .D(ZCount4_q0), .E(ZCount3_q3), .B(ZCount4_q2),
    .STLD(Load_Shift_Registers), .H(ZCount3_q0), .G(ZCount3_q1), .F(ZCount3_q2), .CLK(SSC), .CLRN(1'b1),
    .CLKIH(1'b0), .QH(SSI_C14_qh));
  \74166  \SSI-C13  (
    .SER(SSI_C14_qh), .A(ZCount2_q3), .C(ZCount2_q1), .D(ZCount2_q0), .E(ZCount1_q3), .B(ZCount2_q2),
    .STLD(Load_Shift_Registers), .H(ZCount1_q0), .G(ZCount1_q1), .F(ZCount1_q2), .CLK(SSC), .CLRN(1'b1),
    .CLKIH(1'b0), .QH(SSI_C13_qh));
  \74166  \SSI-C12  (
    .SER(SSI_C13_qh), .A(YCount5_q3), .C(YCount5_q1), .D(YCount5_q0), .E(YCount4_q3), .B(YCount5_q2),
    .STLD(Load_Shift_Registers), .H(YCount4_q0), .G(YCount4_q1), .F(YCount4_q2), .CLK(SSC), .CLRN(1'b1),
    .CLKIH(1'b0), .QH(SSI_C12_qh));
  \74166  \SSI-C11  (
    .SER(SSI_C12_qh), .A(YCount3_q3), .C(YCount3_q1), .D(YCount3_q0), .E(YCount2_q3), .B(YCount3_q2),
    .STLD(Load_Shift_Registers), .H(YCount2_q0), .G(YCount2_q1), .F(YCount2_q2), .CLK(SSC), .CLRN(1'b1),
    .CLKIH(1'b0), .QH(SSI_C11_qh));
  \74166  \SSI-C10  (
    .SER(SSI_C11_qh), .A(YCount1_q3), .C(YCount1_q1), .D(YCount1_q0), .E(XCount5_q3), .B(YCount1_q2),
    .STLD(Load_Shift_Registers), .H(XCount5_q0), .G(XCount5_q1), .F(XCount5_q2), .CLK(SSC), .CLRN(1'b1),
    .CLKIH(1'b0), .QH(SSI_C10_qh));
  \74166  \SSI-C9  (
    .SER(SSI_C10_qh), .A(XCount4_q3), .C(XCount4_q1), .D(XCount4_q0), .E(XCount3_q3), .B(XCount4_q2),
    .STLD(Load_Shift_Registers), .H(XCount3_q0), .G(XCount3_q1), .F(XCount3_q2), .CLK(SSC), .CLRN(1'b1),
    .CLKIH(1'b0), .QH(SSI_C9_qh));
  \74166  \SSI-C7  (
    .SER(SSI_C9_qh), .A(XCount2_q3), .C(XCount2_q1), .D(XCount2_q0), .E(XCount1_q3), .B(XCount2_q2),
    .STLD(Load_Shift_Registers), .H(XCount1_q0), .G(XCount1_q1), .F(XCount1_q2), .CLK(SSC), .CLRN(1'b1),
    .CLKIH(1'b0), .QH(SSI_C7_qh));

  assign GND_11a = 1'b0;
  assign GND_13b = 1'b0;
  assign GND_20b = 1'b0;
  assign GND_21a = 1'b0;
  assign GND_22a = 1'b0;
  assign GND_23a = 1'b0;
  assign GND_24a = 1'b0;
  assign GND_25a = 1'b0;
  assign GND_25b = 1'b0;
  assign Probe_old_Enable = Probe_Input;
  assign ZW_Pwr = ZW_Power;
endmodule
